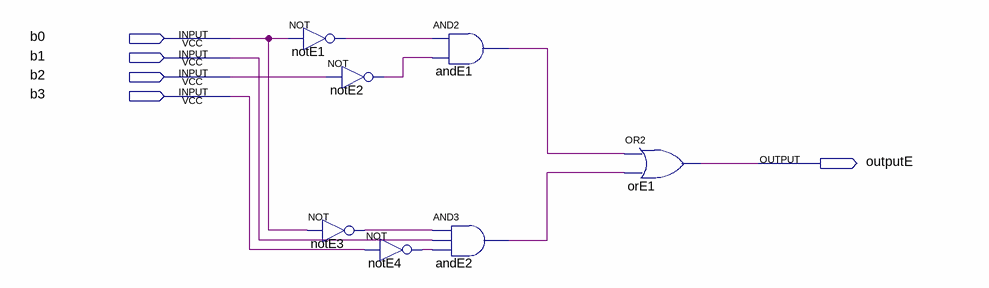
[diagram p0: schematic sheet]
// Quartus schematic e.bdf as structural Verilog: 7 symbols, 5 pins
module e (
  input  b0,
  input  b1,
  input  b2,
  input  b3,
  output outputE
);

  wire andE1_out, andE2_out, notE1_out, notE2_out, notE3_out, notE4_out;

  not notE1 (notE1_out, b0);
  not notE2 (notE2_out, b2);
  not notE3 (notE3_out, b0);
  not notE4 (notE4_out, b3);
  and andE1 (andE1_out, notE1_out, notE2_out);
  and andE2 (andE2_out, notE3_out, b1, notE4_out);
  or orE1 (outputE, andE1_out, andE2_out);
endmodule
